# Altium schematic sheet B45160514D.SCHDOC
size A2
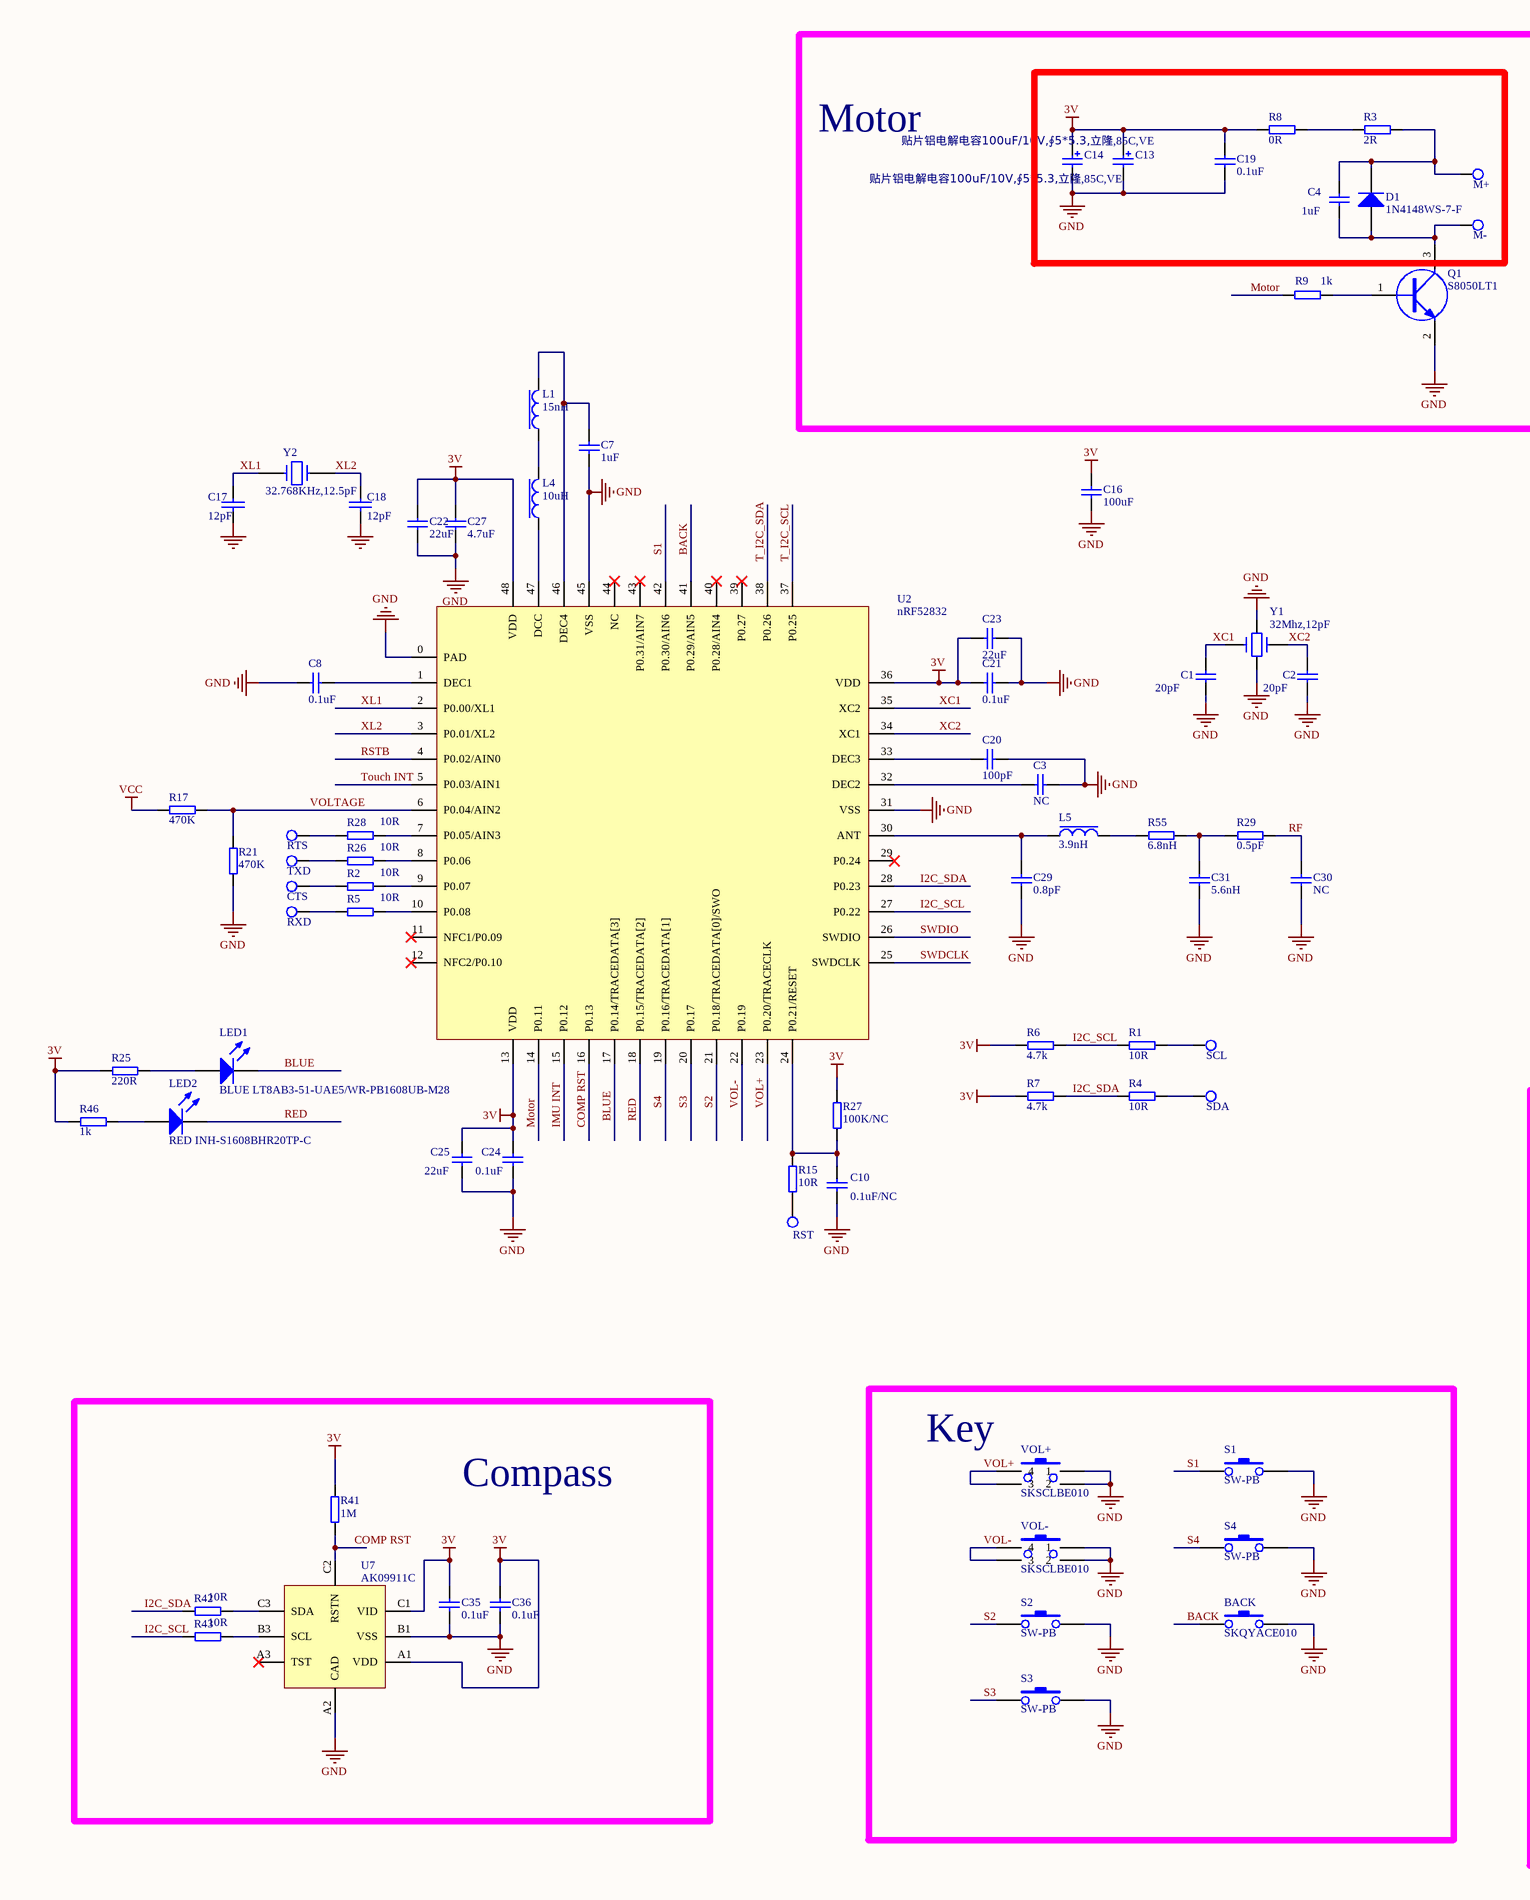
[diagram p0: B45160514D.SCHDOC, left]
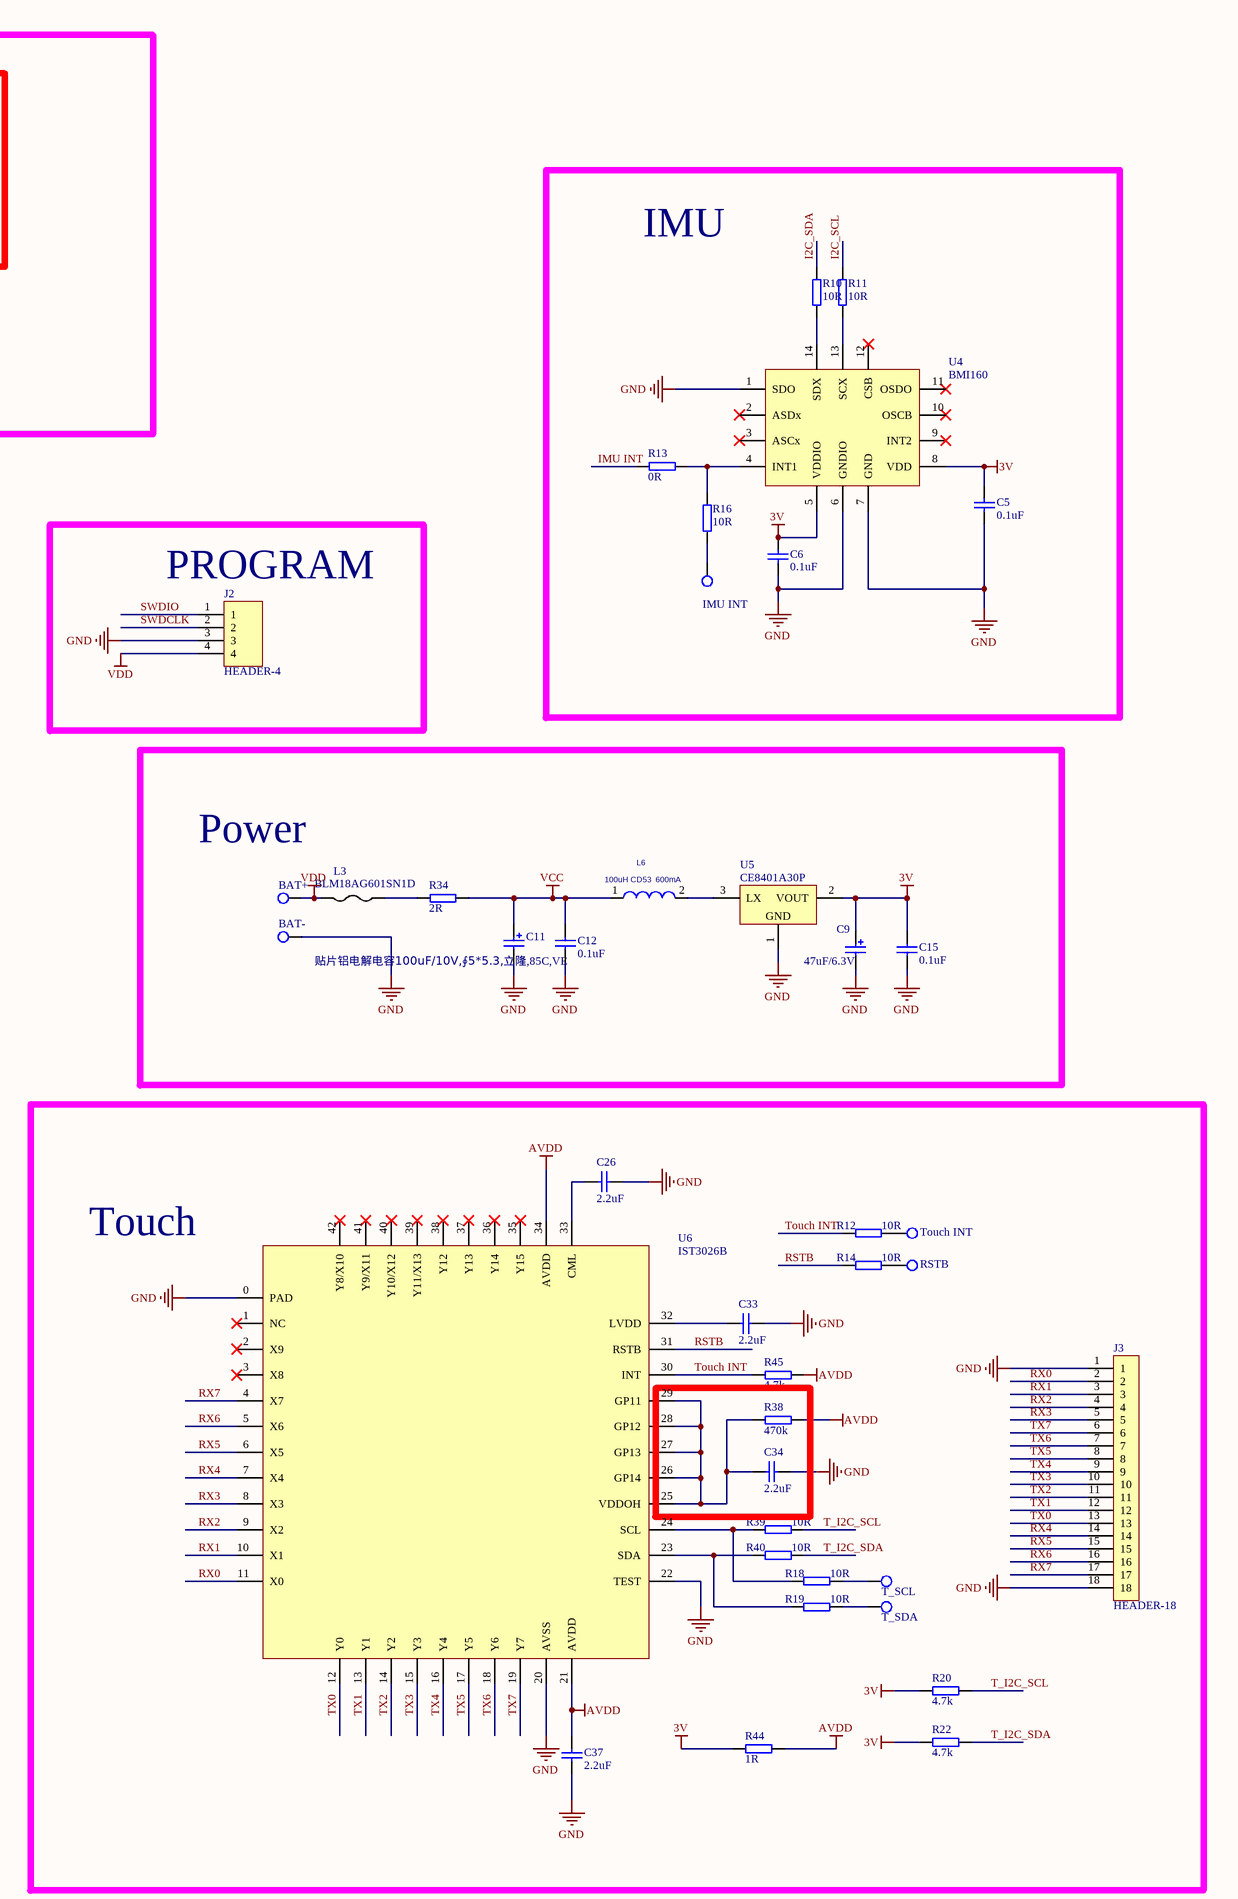
[diagram p1: B45160514D.SCHDOC, right]

## Parts
BACK  SKQYACE010  [SKQYACE010]
BAT+  TAP  [BAT]  (value not drawn)
BAT-  TAP  [BAT]  (value not drawn)
C1  20pF  [C-0402]
C2  20pF  [C-0402]
C3  NC  [C-0402]
C4  1uF  [C-0402]
C5  0.1uF  [C-0402]
C6  0.1uF  [C-0402]
C7  1uF  [C-0603]
C8  0.1uF  [C-0402]
C9  47uF/6.3V  [C-1206]
C10  0.1uF/NC  [C-0402]
C11  贴片铝电解电容100uF/10V,∮5*5.3,立隆,85C,VE  [CAP_ALUM-C]
C12  0.1uF  [C-0603]
C13  贴片铝电解电容100uF/10V,∮5*5.3,立隆,85C,VE  [CAP_ALUM-C]
C14  贴片铝电解电容100uF/10V,∮5*5.3,立隆,85C,VE  [CAP_ALUM-C]
C15  0.1uF  [C-0603]
C16  100uF  [C-1206]
C17  12pF  [C-0402]
C18  12pF  [C-0402]
C19  0.1uF  [C-0603]
C20  100pF  [C-0402]
C21  0.1uF  [C-0402]
C22  22uF  [C-0805]
C23  22uF  [C-0805]
C24  0.1uF  [C-0402]
C25  22uF  [C-0805]
C26  2.2uF  [C-0402]
C27  4.7uF  [C-0603]
C29  0.8pF  [C-0402]
C30  NC  [C-0402]
C31  5.6nH  [C-0402]
C33  2.2uF  [C-0402]
C34  2.2uF  [C-0402]
C35  0.1uF  [C-0402]
C36  0.1uF  [C-0402]
C37  2.2uF  [C-0402]
CTS  TAP  [TS-1.0]  (value not drawn)
D1  1N4148WS-7-F  [SOD-323]
IMU_INT  TAP  [TS-1.0]  (value not drawn)
J2  HEADER-4  [PH-4-2.0]
J3  HEADER-18  [0.5E-18PBX-P]
L1  15nH  [R-0402]
L3  BLM18AG601SN1D  [R-0603]
L4  10uH  [R-0805]
L5  3.9nH  [R-0402]
L6  100uH CD53  600mA  [FPI0503F-101M]
LED1  BLUE LT8AB3-51-UAE5/WR-PB1608UB-M28  [LED-0603]
LED2  RED INH-S1608BHR20TP-C  [LED-0603]
M+  TAP  [TS-1.5*2]  (value not drawn)
M-  TAP  [TS-1.5*2]  (value not drawn)
Q1  S8050LT1  [SOT-23]
R1  10R  [R-0402]
R2  10R  [R-0402]
R3  2R  [R-0805]
R4  10R  [R-0402]
R5  10R  [R-0402]
R6  4.7k  [R-0402]
R7  4.7k  [R-0402]
R8  0R  [R-0805]
R9  1k  [R-0402]
R10  10R  [R-0402]
R11  10R  [R-0402]
R12  10R  [R-0402]
R13  0R  [R-0402]
R14  10R  [R-0402]
R15  10R  [R-0402]
R16  10R  [R-0402]
R17  470K  [R-0402]
R18  10R  [R-0402]
R19  10R  [R-0402]
R20  4.7k  [R-0402]
R21  470K  [R-0402]
R22  4.7k  [R-0402]
R25  220R  [R-0603]
R26  10R  [R-0402]
R27  100K/NC  [R-0402]
R28  10R  [R-0402]
R29  0.5pF  [R-0402]
R34  2R  [R-0603]
R38  470k  [R-0402]
R39  10R  [R-0402]
R40  10R  [R-0402]
R41  1M  [R-0402]
R42  10R  [R-0402]
R43  10R  [R-0402]
R44  1R  [R-0402]
R45  4.7k  [R-0402]
R46  1k  [R-0603]
R55  6.8nH  [R-0402]
RST  TAP  [TS-1.0]  (value not drawn)
RSTB  TAP  [TS-1.0]  (value not drawn)
RTS  TAP  [TS-1.0]  (value not drawn)
RXD  TAP  [TS-1.0]  (value not drawn)
S1  SW-PB  [K mat D5]
S2  SW-PB  [K mat D5]
S3  SW-PB  [K mat D5]
S4  SW-PB  [K mat D5]
SCL  TAP  [TS-1.0]  (value not drawn)
SDA  TAP  [TS-1.0]  (value not drawn)
T_SCL  TAP  [TS-1.0]  (value not drawn)
T_SDA  TAP  [TS-1.0]  (value not drawn)
Touch_INT  TAP  [TS-1.0]  (value not drawn)
TXD  TAP  [TS-1.0]  (value not drawn)
U2  nRF52832  [QFN-48-6*6-0.4]
U4  BMI160  [LGA14]
U5  CE8401A30P  [SOT89]
U6  IST3026B  [uTQFN-42-4.5*4.5]
U7  AK09911C  [AK09911C]
VOL+  SKSCLBE010  [SKSCLBE010]
VOL-  SKSCLBE010  [SKSCLBE010]
Y1  32Mhz,12pF  [XD3225-1-12M-125M]
Y2  32.768KHz,12.5pF  [32.768Khz-3215]

## Blocks framed on the sheet
Motor: C4 C13 C14 C19 D1 M+ M- Q1 R3 R8 R9
IMU: C5 C6 IMU_INT R10 R11 R13 R16 U4
PROGRAM: J2
Power: BAT+ BAT- C9 C11 C12 C15 L3 L6 R34 U5
Touch: C26 C33 C34 C37 J3 R12 R14 R18-R20 R22 R38-R40 R44 R45 RSTB T_SCL T_SDA Touch_INT U6
Compass: C35 C36 R41-R43 U7
Key: BACK S1-S4 VOL+ VOL-

## Nets
3V: C5.1 C6.1 C9.1 C13.1 C14.1 C15.1 C16.1 C19.1 C21.1 C22.2 C23.1 C24.1 C25.1 C27.1 C35.1 C36.2 R6.1 R7.1 R8.2 R20.1 R22.1 R25.2 R27.1 R41.1 R44.1 R46.2 U2.13(VDD) U2.36(VDD) U2.48(VDD) U4.5(VDDIO) U4.8(VDD) U5.2(VOUT) U7.A1(VDD) U7.C1(VID)
AVDD: C37.1 R38.2 R44.2 R45.2 U6.21(AVDD) U6.34(AVDD)
GND: BACK.1 BAT-.1 C1.2 C2.2 C3.2 C5.2 C6.2 C7.1 C8.1 C9.2 C10.2 C11.2 C12.2 C13.2 C14.2 C15.2 C16.2 C17.2 C18.2 C19.2 C20.2 C21.2 C22.1 C23.2 C24.2 C25.2 C26.1 C27.2 C29.2 C30.2 C31.2 C33.2 C34.2 C35.2 C36.1 C37.2 J2.3 J3.1 J3.18 Q1.2(e) R21.1 S1.2 S2.2 S3.1 S4.2 U2.0(PAD) U2.31(VSS) U2.45(VSS) U4.1(SDO) U4.6(GNDIO) U4.7(GND) U5.1(GND) U6.0(PAD) U6.20(AVSS) U6.22(TEST) U7.A2(CAD) U7.B1(VSS) VOL+.1 VOL+.2 VOL-.1 VOL-.2 Y1.3
VCC: C11.1 C12.1 L6.1 R17.1 R34.1
VDD: BAT+.1 J2.4 L3.2
BACK: BACK.2 U2.41(P0.29/AIN5)
BLUE: LED1.2 U2.17(P0.14/TRACEDATA[3])
COMP RST: R41.2 U2.16(P0.13) U7.C2(RSTN)
I2C_SCL: R1.1 R6.2 R11.2 R43.1 U2.27(P0.22)
I2C_SDA: R4.1 R7.2 R10.2 R42.1 U2.28(P0.23)
IMU INT: R13.1 U2.15(P0.12)
Motor: R9.1 U2.14(P0.11)
RED: LED2.2 U2.18(P0.15/TRACEDATA[2])
RF: C30.1 R29.2
RSTB: R14.1 U2.4(P0.02/AIN0) U6.31(RSTB)
RX0: J3.2 U6.11(X0)
RX1: J3.3 U6.10(X1)
RX2: J3.4 U6.9(X2)
RX3: J3.5 U6.8(X3)
RX4: J3.14 U6.7(X4)
RX5: J3.15 U6.6(X5)
RX6: J3.16 U6.5(X6)
RX7: J3.17 U6.4(X7)
S1: S1.1 U2.42(P0.30/AIN6)
S2: S2.1 U2.21(P0.18/TRACEDATA[0]/SWO)
S3: S3.2 U2.20(P0.17)
S4: S4.1 U2.19(P0.16/TRACEDATA[1])
SWDCLK: J2.2 U2.25(SWDCLK)
SWDIO: J2.1 U2.26(SWDIO)
T_I2C_SCL: R20.2 R39.2 U2.37(P0.25)
T_I2C_SDA: R22.2 R40.2 U2.38(P0.26)
Touch INT: R12.1 R45.1 U2.5(P0.03/AIN1) U6.30(INT)
TX0: J3.13 U6.12(Y0)
TX1: J3.12 U6.13(Y1)
TX2: J3.11 U6.14(Y2)
TX3: J3.10 U6.15(Y3)
TX4: J3.9 U6.16(Y4)
TX5: J3.8 U6.17(Y5)
TX6: J3.7 U6.18(Y6)
TX7: J3.6 U6.19(Y7)
VOL+: U2.23(P0.20/TRACECLK) VOL+.3 VOL+.4
VOL-: U2.22(P0.19) VOL-.3 VOL-.4
VOLTAGE: R17.2 R21.2 U2.6(P0.04/AIN2)
XC1: C1.1 U2.35(XC2) Y1.1
XC2: C2.1 U2.34(XC1) Y1.2
XL1: C17.1 U2.2(P0.00/XL1) Y2.1
XL2: C18.1 U2.3(P0.01/XL2) Y2.2
NetC3_1: C3.1 U2.32(DEC2)
NetC4_1: C4.1 D1.2 M+.1 R3.1
NetC4_2: C4.2 D1.1 M-.1 Q1.3(c)
NetC7_2: C7.2 L1.2 U2.46(DEC4)
NetC8_2: C8.2 U2.1(DEC1)
NetC10_1: C10.1 R15.2 R27.2 U2.24(P0.21/RESET)
NetC20_1: C20.1 U2.33(DEC3)
NetC26_2: C26.2 U6.33(CML)
NetC29_1: C29.1 L5.1 U2.30(ANT)
NetC31_1: C31.1 R29.1 R55.2
NetC33_1: C33.1 U6.32(LVDD)
NetC34_1: C34.1 R38.1 U6.25(VDDOH) U6.26(GP14) U6.27(GP13) U6.28(GP12) U6.29(GP11)
NetCTS_1: CTS.1 R2.2
NetIMU_INT_1: IMU_INT.1 R16.1
NetL1_1: L1.1 L4.2
NetL3_1: L3.1 R34.2
NetL4_1: L4.1 U2.47(DCC)
NetL5_2: L5.2 R55.1
NetL6_2: L6.2 U5.3(LX)
NetLED1_1: LED1.1 R25.1
NetLED2_1: LED2.1 R46.1
NetQ1_1: Q1.1(b) R9.2
NetR1_2: R1.2 SCL.1
NetR2_1: R2.1 U2.9(P0.07)
NetR3_2: R3.2 R8.1
NetR4_2: R4.2 SDA.1
NetR5_1: R5.1 U2.10(P0.08)
NetR5_2: R5.2 RXD.1
NetR10_1: R10.1 U4.14(SDX)
NetR11_1: R11.1 U4.13(SCX)
NetR12_2: R12.2 Touch_INT.1
NetR13_2: R13.2 R16.2 U4.4(INT1)
NetR14_2: R14.2 RSTB.1
NetR15_1: R15.1 RST.1
NetR18_1: R18.1 R39.1 U6.24(SCL)
NetR18_2: R18.2 T_SCL.1
NetR19_1: R19.1 R40.1 U6.23(SDA)
NetR19_2: R19.2 T_SDA.1
NetR26_1: R26.1 U2.8(P0.06)
NetR26_2: R26.2 TXD.1
NetR28_1: R28.1 U2.7(P0.05/AIN3)
NetR28_2: R28.2 RTS.1
NetR42_2: R42.2 U7.C3(SDA)
NetR43_2: R43.2 U7.B3(SCL)

Not connected (* = marked no-connect by the designer): U2 11(NFC1/P0.09)* 12(NFC2/P0.10)* 29(P0.24)* 39(P0.27)* 40(P0.28/AIN4)* 43(P0.31/AIN7)* 44(NC)*; U4 2(ASDx)* 3(ASCx)* 9(INT2)* 10(OSCB)* 11(OSDO)* 12(CSB)*; U6 1(NC)* 2(X9)* 3(X8)* 35(Y15)* 36(Y14)* 37(Y13)* 38(Y12)* 39(Y11/X13)* 40(Y10/X12)* 41(Y9/X11)* 42(Y8/X10)*; U7 A3(TST)*

## Library data of the parts
BACK = SW-PB
C1-C4 C7 C8 C10 C20-C25 C27 C29-C31 = CAP: 9NC: 4.5.2.000980
C5 C6 C35 C36 = Cap: capacitor 27 pF NPO , +/- 2 %, SMD case 0603; Manufacturer: Generic Components; Class: Passive; Value: 27pF; Published: 08/06/2000; Publisher: Altium Hobart Technology Centre; SubClass: Capacitor
C9 C11 C13 C14 = CAP E
C12 C15 C16 C19 C26 C33 C34 C37 = CAP
C17 C18 = CAP: Capacitor
D1 = DIODE
L1 L4 L5 = INDUCTOR
L3 = Inductance
L6 = INDUCTOR_Dup1
LED1 LED2 = LED
Q1 = NPN: NPN型晶体管
R1-R22 R25-R29 R34 R38-R46 R55 = RES
U5 = CE8401A33P
VOL+ VOL- = SW-PB4
Y1 = CRYSTAL4
Y2 = CRYSTAL2